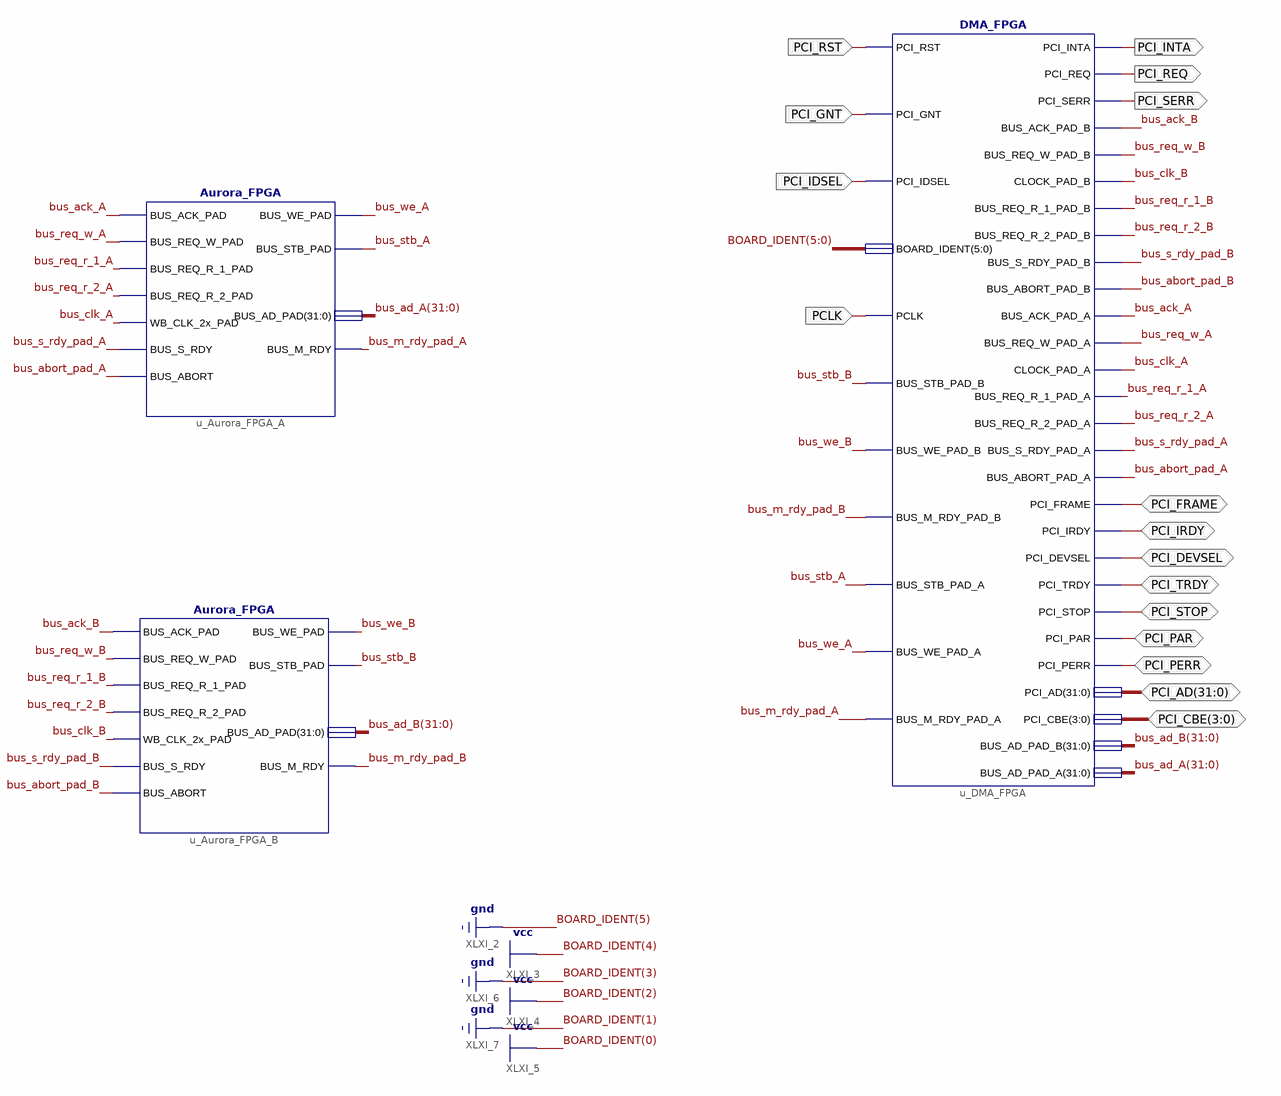
[diagram p0: schematic sheet 1]
// Xilinx ISE schematic BOARD_TOP_SIM.sch (spartan6) as structural Verilog: 3 symbols, 16 ports
module BOARD_TOP_SIM (
  input  PCLK,
  input  PCI_IDSEL,
  input  PCI_GNT,
  input  PCI_RST,
  inout  PCI_FRAME,
  inout  PCI_IRDY,
  inout  PCI_DEVSEL,
  inout  PCI_TRDY,
  inout  PCI_STOP,
  inout  PCI_PAR,
  inout  PCI_PERR,
  inout  [31:0] PCI_AD,
  inout  [3:0] PCI_CBE,
  output PCI_SERR,
  output PCI_REQ,
  output PCI_INTA
);

  wire bus_abort_pad_A, bus_abort_pad_B, bus_ack_A, bus_ack_B, bus_clk_A, bus_clk_B, bus_m_rdy_pad_A,
       bus_m_rdy_pad_B, bus_req_r_1_A, bus_req_r_1_B, bus_req_r_2_A, bus_req_r_2_B, bus_req_w_A, bus_req_w_B,
       bus_s_rdy_pad_A, bus_s_rdy_pad_B, bus_stb_A, bus_stb_B, bus_we_A, bus_we_B;
  wire [31:0] bus_ad_A, bus_ad_B;

  Aurora_FPGA u_Aurora_FPGA_B (
    .BUS_ACK_PAD(bus_ack_B), .BUS_REQ_W_PAD(bus_req_w_B), .BUS_REQ_R_1_PAD(bus_req_r_1_B),
    .BUS_REQ_R_2_PAD(bus_req_r_2_B), .WB_CLK_2x_PAD(bus_clk_B), .BUS_WE_PAD(bus_we_B),
    .BUS_STB_PAD(bus_stb_B), .BUS_AD_PAD(bus_ad_B), .BUS_S_RDY(bus_s_rdy_pad_B), .BUS_ABORT(bus_abort_pad_B),
    .BUS_M_RDY(bus_m_rdy_pad_B));
  Aurora_FPGA u_Aurora_FPGA_A (
    .BUS_ACK_PAD(bus_ack_A), .BUS_REQ_W_PAD(bus_req_w_A), .BUS_REQ_R_1_PAD(bus_req_r_1_A),
    .BUS_REQ_R_2_PAD(bus_req_r_2_A), .WB_CLK_2x_PAD(bus_clk_A), .BUS_WE_PAD(bus_we_A),
    .BUS_STB_PAD(bus_stb_A), .BUS_AD_PAD(bus_ad_A), .BUS_S_RDY(bus_s_rdy_pad_A), .BUS_ABORT(bus_abort_pad_A),
    .BUS_M_RDY(bus_m_rdy_pad_A));
  DMA_FPGA u_DMA_FPGA (
    .PCI_RST(PCI_RST), .PCI_GNT(PCI_GNT), .PCI_IDSEL(PCI_IDSEL), .BOARD_IDENT(6'b010101), .PCLK(PCLK),
    .BUS_STB_PAD_B(bus_stb_B), .BUS_WE_PAD_B(bus_we_B), .BUS_M_RDY_PAD_B(bus_m_rdy_pad_B),
    .BUS_STB_PAD_A(bus_stb_A), .BUS_WE_PAD_A(bus_we_A), .BUS_M_RDY_PAD_A(bus_m_rdy_pad_A),
    .PCI_INTA(PCI_INTA), .PCI_REQ(PCI_REQ), .PCI_SERR(PCI_SERR), .BUS_ACK_PAD_B(bus_ack_B),
    .BUS_REQ_W_PAD_B(bus_req_w_B), .CLOCK_PAD_B(bus_clk_B), .BUS_REQ_R_1_PAD_B(bus_req_r_1_B),
    .BUS_S_RDY_PAD_B(bus_s_rdy_pad_B), .BUS_ABORT_PAD_B(bus_abort_pad_B), .BUS_ACK_PAD_A(bus_ack_A),
    .BUS_REQ_W_PAD_A(bus_req_w_A), .CLOCK_PAD_A(bus_clk_A), .BUS_REQ_R_1_PAD_A(bus_req_r_1_A),
    .BUS_REQ_R_2_PAD_A(bus_req_r_2_A), .BUS_S_RDY_PAD_A(bus_s_rdy_pad_A), .BUS_ABORT_PAD_A(bus_abort_pad_A),
    .PCI_FRAME(PCI_FRAME), .PCI_IRDY(PCI_IRDY), .PCI_DEVSEL(PCI_DEVSEL), .PCI_TRDY(PCI_TRDY),
    .PCI_STOP(PCI_STOP), .PCI_PAR(PCI_PAR), .PCI_PERR(PCI_PERR), .PCI_AD(PCI_AD), .PCI_CBE(PCI_CBE),
    .BUS_AD_PAD_B(bus_ad_B), .BUS_AD_PAD_A(bus_ad_A), .BUS_REQ_R_2_PAD_B(bus_req_r_2_B));
endmodule
